# Altium schematic sheet Airspeed1_B3.SchDoc
size A3; SheetNumber: 3; SheetTotal: 3
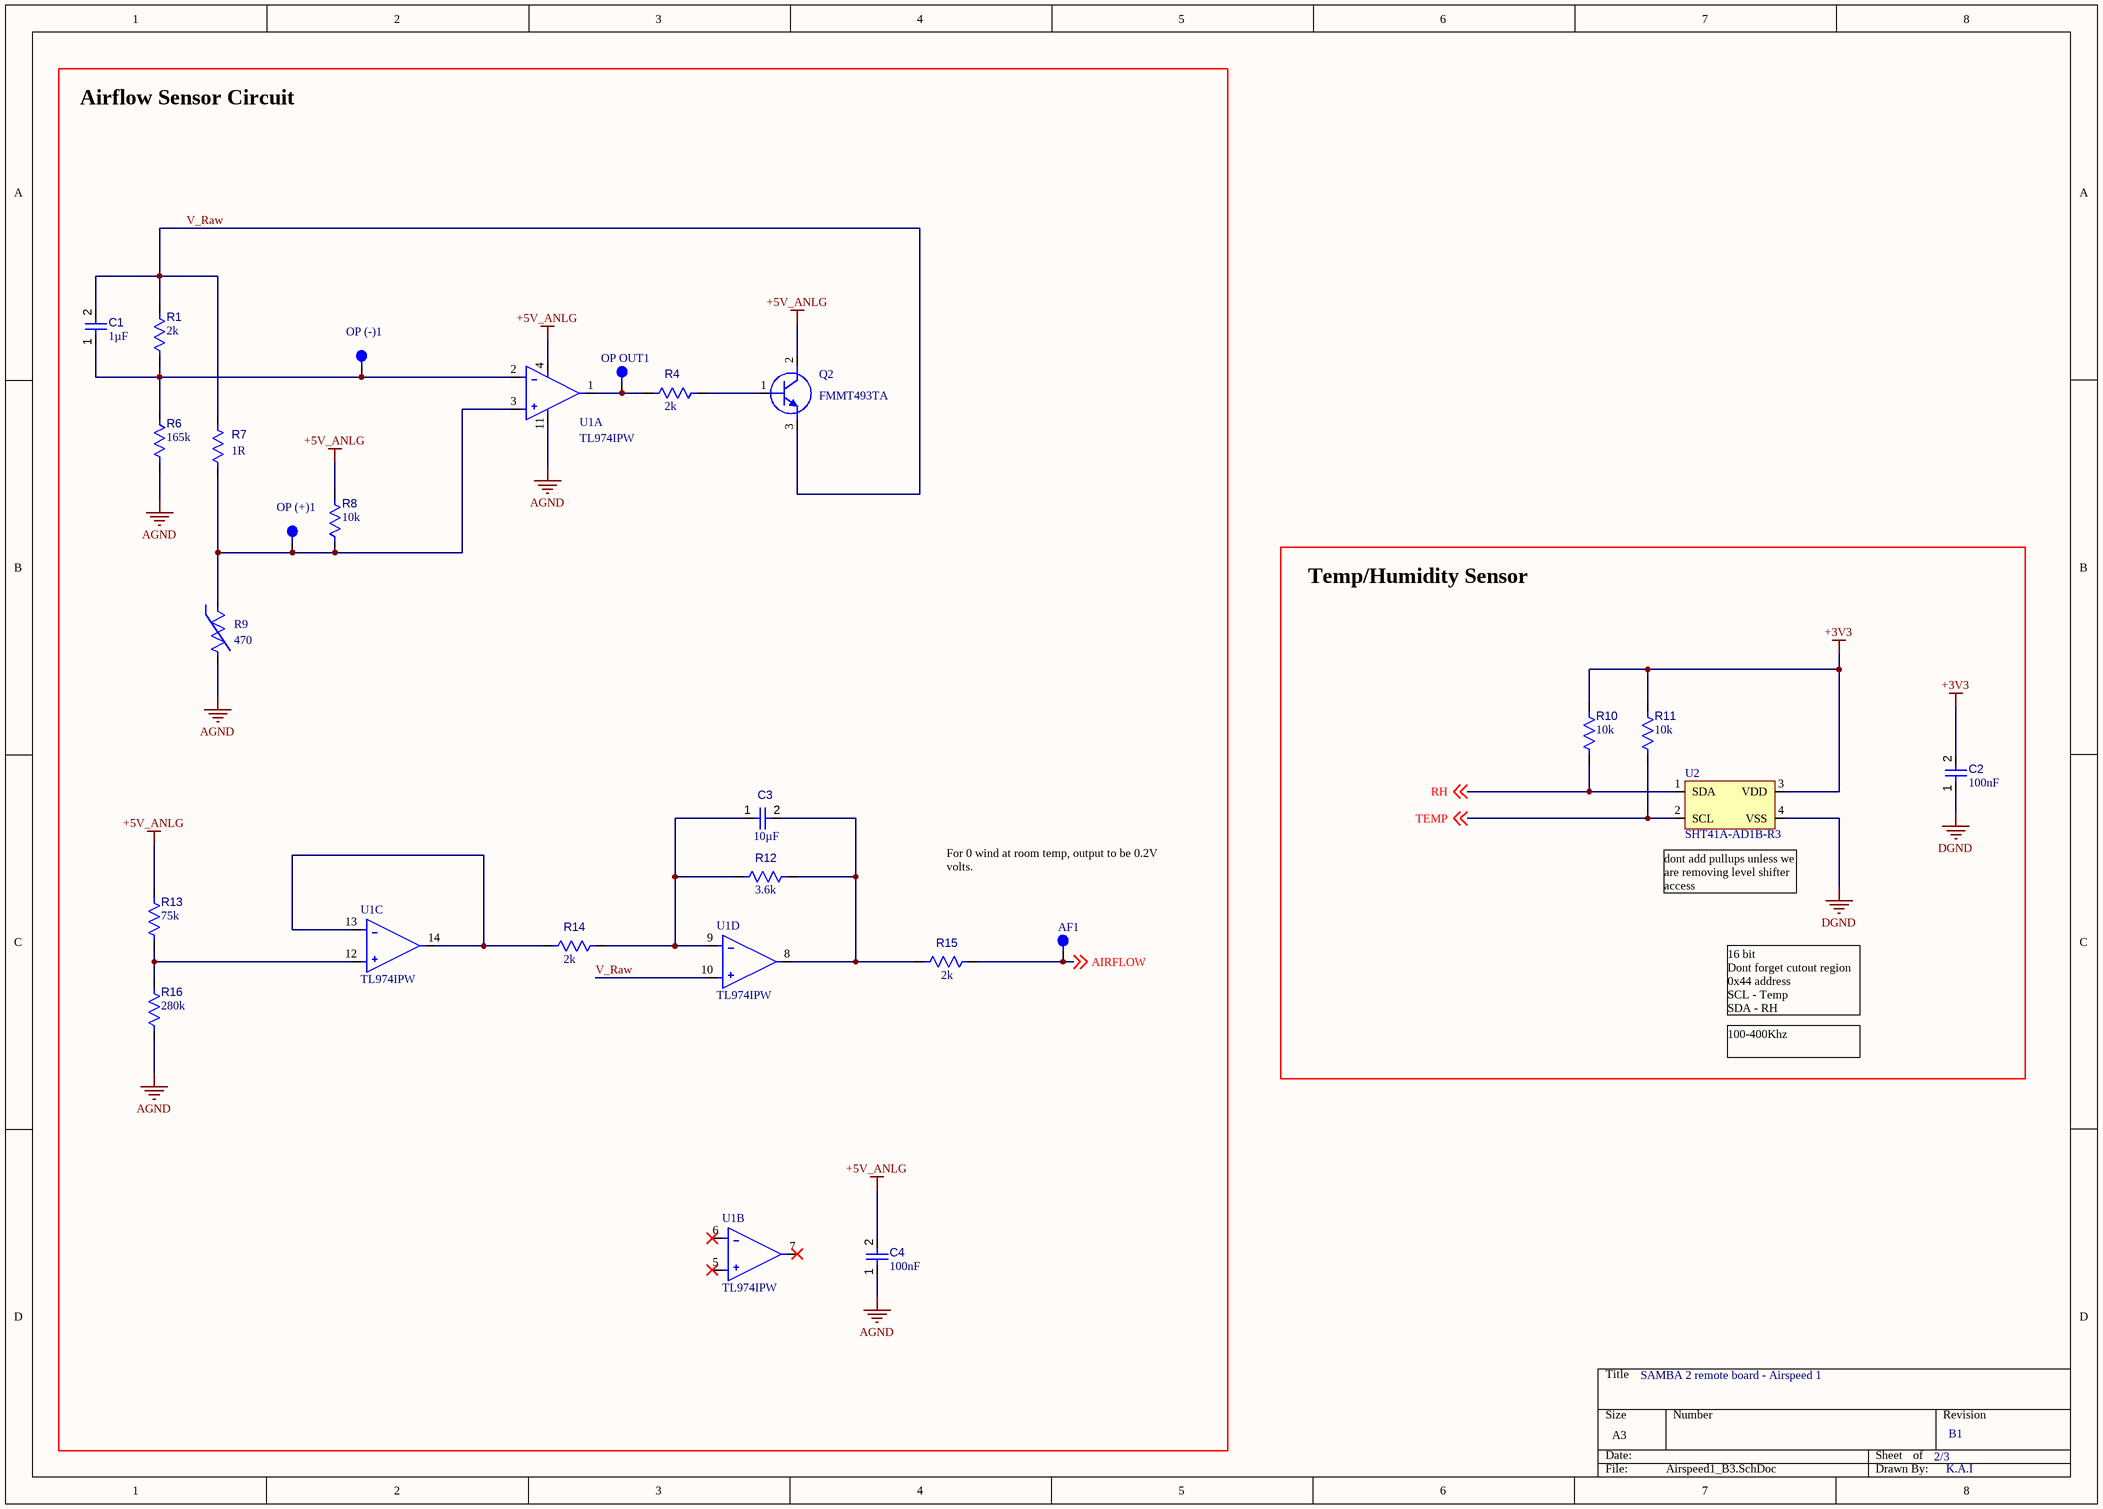
[diagram p0: Airspeed1_B3.SchDoc]

## Parts
AF1  PH1-01-UA  [FP-PH1-01-UA-MFG]  (value not drawn)  (no BOM)
C1  value 1µF  [MANUF_CAP_0603]  (hidden comment: CL10B105KA8NFNC)
C2  value 100nF  [MANUF_CAP_0603]  (hidden comment: CC0603KRX7R7BB104)
C3  value 10µF  [FP-GRM188-0_15-MFG]  (hidden comment: GRM188R61A106ME69D)
C4  value 100nF  [MANUF_CAP_0603]  (hidden comment: CC0603KRX7R7BB104)
OP_(+)1  PH1-01-UA  [FP-PH1-01-UA-MFG]  (value not drawn)  (no BOM)
OP_(-)1  PH1-01-UA  [FP-PH1-01-UA-MFG]  (value not drawn)  (no BOM)
OP_OUT1  PH1-01-UA  [FP-PH1-01-UA-MFG]  (value not drawn)  (no BOM)
Q2  FMMT493TA  [SOT95P237X110-3N]
R1  value 2k  [MANUF_RES_0603]  (hidden comment: ERJ-3EKF2001V)
R4  value 2k  [MANUF_RES_0603]  (hidden comment: ERJ-3EKF2001V)
R6  value 165k  [RESC1608X55X30NL15T15]  (hidden comment: ERJ-3EKF1653V)
R7  value 1R  [Vishay_CRCW0805-HPe3_MFG]  (hidden comment: CRCW08051R00FKEAHP)
R8  value 10k  [MANUF_RES_0603]  (hidden comment: RC0603FR-0710KL)
R9  value 470  [NTCG103NH471JT1-Footprint-1]  (hidden comment: NTCG103NH471JT1)
R10  value 10k  [MANUF_RES_0603]  (hidden comment: RC0603FR-0710KL)
R11  value 10k  [MANUF_RES_0603]  (hidden comment: RC0603FR-0710KL)
R12  value 3.6k  [RESC1609X50X30NL08T20]  (hidden comment: CRCW06033K60FKEAC)
R13  value 75k  [IPC B 0603 RES]  (hidden comment: AC0603FR-0775KL)
R14  value 2k  [MANUF_RES_0603]  (hidden comment: ERJ-3EKF2001V)
R15  value 2k  [MANUF_RES_0603]  (hidden comment: ERJ-3EKF2001V)
R16  value 280k  [IPC B 0603 RES]  (hidden comment: RC0603FR-07280KL)
U1  TL974IPW  [TSOP65P640X120-14N]  (parts A,B,C,D of 4)
U2  SHT41A-AD1B-R3  [SHT41A-AD1B-R3-Footprint-1]

## Blocks framed on the sheet
Airflow Sensor Circuit: AF1 C1 C3 C4 OP_(+)1 OP_(-)1 OP_OUT1 Q2 R1 R4 R6-R9 R12-R16 U1
Temp/Humidity Sensor: C2 R10 R11 U2

## Nets
+3V3: C2.2 R10.2 R11.2 U2.3(VDD)
+5V_ANLG: C4.2 Q2.2(C) R8.2 R13.2 U1.4(VDD)
AGND: C4.1 R6.1 R9.2 R16.1 U1.11(VSS)
DGND: C2.1 U2.4(VSS)
AIRFLOW: AF1.1 R15.1 ; off-sheet AIRFLOW
RH: R10.1 U2.1(SDA) ; off-sheet RH
TEMP: R11.1 U2.2(SCL) ; off-sheet TEMP
V_Raw: C1.2 Q2.3(E) R1.2 R7.2 U1.10(+IN_C)
NetC1_1: C1.1 OP_(-)1.1 R1.1 R6.2 U1.2(-IN_A)
NetC3_1: C3.1 R12.1 R14.1 U1.9(-IN_C)
NetC3_2: C3.2 R12.2 R15.2 U1.8(OUT_C)
NetOP_(+)1_1: OP_(+)1.1 R7.1 R8.1 R9.1 U1.3(+IN_A)
NetOP_OUT1_1: OP_OUT1.1 R4.2 U1.1(OUT_A)
NetQ2_1: Q2.1(B) R4.1
NetR13_1: R13.1 R16.2 U1.12(+IN_D)
NetR14_2: R14.2 U1.13(-IN_D) U1.14(OUT_D)

Not connected (* = marked no-connect by the designer): U1 5(+IN_B)* 6(-IN_B)* 7(OUT_B)*

## Notes on the sheet
- For 0 wind at room temp, output to be 0.2V volts.
- (near U2) dont add pullups unless we are removing level shifter access
- 16 bit
  Dont forget cutout region
  0x44 address
  SCL - Temp
  SDA - RH
- 100-400Khz
- SAMBA 2 remote board - Airspeed 1
- 2/3
- B1
- K.A.I

## Library data of the parts
AF1 OP_(+)1 OP_(-)1 OP_OUT1 = CMP-002-00083-1: Conn Unshrouded Header HDR 1 POS 2.54mm Solder ST Thru-Hole Bag
C1 = CMP-001-00098-2: Ceramic Capacitor, Multilayer, Ceramic, 25V, 10% +Tol, 10% -Tol, X7R, 15% TC, 1uF, Surface Mount, 0603; Pins: 2; Mounting Technology: Surface Mount; Min Operating Temperature: -55°C; Case/Package: 0603; Capacitor Type: Ceramic; RoHS Compliant: Yes; Max Operating Temperature: 125°C
C2 C4 = CMP-001-00099-4: Ceramic Capacitor, Multilayer, Ceramic, 16V, 10% +Tol, 10% -Tol, X7R, 15% TC, 0.1uF, Surface Mount, 0603; Pins: 2; Min Operating Temperature: -55°C; Max Operating Temperature: 125°C; Case/Package: 0603; RoHS Compliant: Yes; Mounting Technology: Surface Mount; Capacitor Type: Ceramic
C3 = CMP-001-00097-1: Ceramic Capacitor, Multilayer, Ceramic, 10V, 20% +Tol, 20% -Tol, X5R, 15% TC, 10uF, Surface Mount, 0603; Min Operating Temperature: -55°C; RoHS Compliant: Yes; Pins: 2; Capacitor Type: Ceramic; Max Operating Temperature: 85°C; Mounting Technology: Surface Mount; Case/Package: 0603
Q2 = CMP-013-00034-1: Small Signal Bipolar Transistor, 1A I(C), 100V V(BR)CEO, 1-Element, NPN, Silicon; Frequency: 150MHz; Max Operating Temperature: 150°C; RoHS Compliant: Yes; Pins: 3
R1 R4 R14 R15 = CMP-009-00207-2: Fixed Resistor, Metal Glaze/thick Film, 0.1W, 2000ohm, 75V, 1% +/-Tol, 100ppm/Cel, Surface Mount, 0603; Power: 100mW; RoHS Compliant: Yes; Pins: 2; Max Operating Temperature: 155°C; Case/Package: 0603; Tolerance: 1%; Mounting Technology: Surface Mount; Min Operating Temperature: -55°C
R6 = CMP-009-00209-1: Fixed Resistor, Metal Glaze/thick Film, 0.1W, 165000ohm, 75V, 1% +/-Tol, 100ppm/Cel, Surface Mount, 0603; Power: 100mW; Pins: 2; RoHS Compliant: Yes; Mounting Technology: Surface Mount; Min Operating Temperature: -55°C; Max Operating Temperature: 155°C; Case/Package: 0603; Tolerance: 1%
R7 = CMP-009-00205-1: Fixed Resistor, Metal Glaze/thick Film, 0.5W, 1ohm, 150V, 1% +/-Tol, 100ppm/Cel, Surface Mount, 0805; Power: 500mW; Pins: 2; Max Operating Temperature: 155°C; Mounting Technology: Surface Mount; RoHS Compliant: Yes; Min Operating Temperature: -55°C; Case/Package: 0805; Tolerance: 1%
R8 R10 R11 = CMP-009-00204-2: Fixed Resistor, Metal Glaze/thick Film, 0.1W, 10000ohm, 75V, 1% +/-Tol, 100ppm/Cel, Surface Mount, 0603; Power: 100mW; Pins: 2; Max Operating Temperature: 155°C; Case/Package: 0603; RoHS Compliant: Yes; Tolerance: 1%; Min Operating Temperature: -55°C; Mounting Technology: Surface Mount
R9 = CMP-009-00192-3: NTC Thermistor, 470ohm, Surface Mount; Tolerance: 5%; Power: 100mW; RoHS Compliant: Yes; Pins: 2; Min Operating Temperature: -40°C; Max Operating Temperature: 125°C; Mounting Technology: Surface Mount
R12 = CMP-009-00200-1: Fixed Resistor, Metal Glaze/thick Film, 0.1W, 3600ohm, 75V, 1% +/-Tol, 100ppm/Cel, Surface Mount, 0603; Power: 100mW; Case/Package: 0603; Min Operating Temperature: -55°C; RoHS Compliant: Yes; Pins: 2; Tolerance: 1%; Max Operating Temperature: 155°C
R13 = CMP-009-00208-1: Fixed Resistor, Metal Glaze/thick Film, 0.1W, 75000ohm, 75V, 1% +/-Tol, 100ppm/Cel, Surface Mount, 0603; Power: 100mW; Max Operating Temperature: 155°C; Tolerance: 1%; Min Operating Temperature: -55°C; Case/Package: 0603; Mounting Technology: Surface Mount; RoHS Compliant: Yes; Pins: 2
R16 = CMP-009-00212-1: Fixed Resistor, Metal Glaze/thick Film, 0.1W, 280000ohm, 75V, 1% +/-Tol, 100ppm/Cel, Surface Mount, 0603; Power: 100mW; Max Operating Temperature: 155°C; Tolerance: 1%; Pins: 2; Case/Package: 0603; Mounting Technology: Surface Mount; RoHS Compliant: Yes; Min Operating Temperature: -55°C
U1 = CMP-014-00004-4: Operational Amplifier, 4 Func, 6000uV Offset-Max, BIPolar, PDSO14; Nominal Supply Voltage: 2.5V; Channels: 4; Max Operating Temperature: 125°C; RoHS Compliant: Yes; Pins: 14; Case/Package: TSSOP; Min Operating Temperature: -40°C
U2 = CMP-010-00024-1: Board Mount Humidity Sensors 4th Gen Humidity and Temperature Sensor